# EAGLE design working (EAGLE 7.7.0)
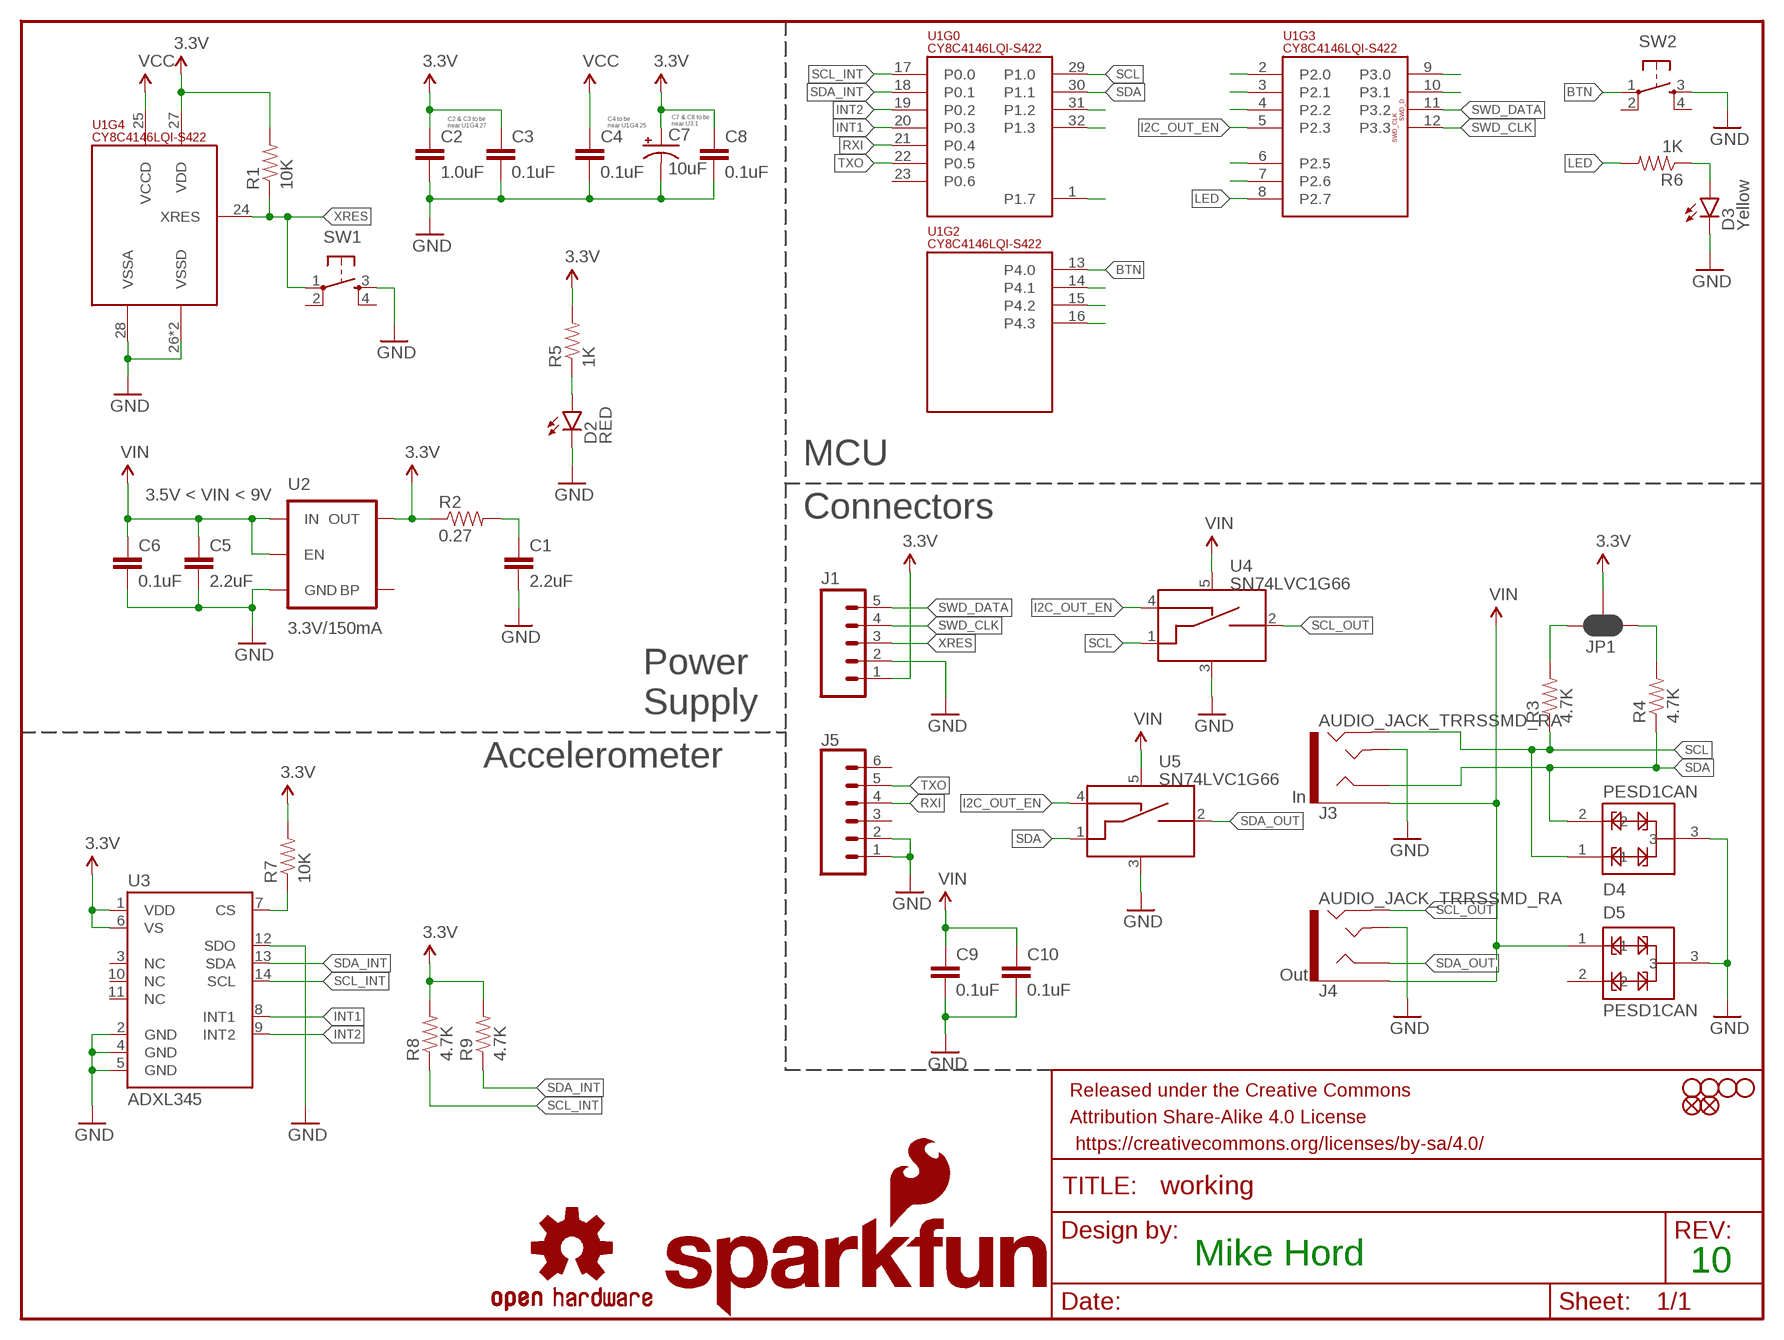
[diagram p0: schematic, sheet 1]

## Parts
C1  2.2uF  2.2UF-10V-20%(0603)  [0603-CAP]
C2  1.0uF  1.0UF-16V-10%(0402)  [0402-CAP]
C3  0.1uF  0.1UF-16V(+-10%)(0402)  [0402-CAP]
C4  0.1uF  0.1UF-16V(+-10%)(0402)  [0402-CAP]
C5  2.2uF  2.2UF-10V-20%(0603)  [0603-CAP]
C6  0.1uF  0.1UF-16V(+-10%)(0402)  [0402-CAP]
C7  10uF  10UF-16V-10%(TANT)  [EIA3216]
C8  0.1uF  0.1UF-16V(+-10%)(0402)  [0402-CAP]
C9  0.1uF  0.1UF-16V(+-10%)(0402)  [0402-CAP]
C10  0.1uF  0.1UF-16V(+-10%)(0402)  [0402-CAP]
D2  RED  LED-RED0603  [LED-0603]
D3  Yellow  LED-YELLOW0603-SMART  [LED-0603]
D4  PESD1CAN  [SOT23-3]
D5  PESD1CAN  [SOT23-3]
FD1  FIDUCIALUFIDUCIAL  [MICRO-FIDUCIAL]
FD2  FIDUCIALUFIDUCIAL  [MICRO-FIDUCIAL]
FRAME1  FRAME-LETTER  [CREATIVE_COMMONS]
H1  STAND-OFF  [STAND-OFF]
H2  STAND-OFF  [STAND-OFF]
H3  STAND-OFF  [STAND-OFF]
H4  STAND-OFF  [STAND-OFF]
J1  M05NO_SILK  [1X05_NO_SILK]
J3  AUDIO_JACK_TRRSSMD_RA  [AUDIO_JACK_3.5MM_TRRS_SMD_RA]
J4  AUDIO_JACK_TRRSSMD_RA  [AUDIO_JACK_3.5MM_TRRS_SMD_RA]
J5  CONN_06NO_SILK_NO_POP  [1X06_NO_SILK]
JP1  JUMPER-PAD-3-NC_BY_PASTE  [PAD-JUMPER-3-NC_BY_PASTE_YES_SILK_FULL_BOX]
LOGO1  SFE_LOGO_NAME_FLAME.1_INCH  [SFE_LOGO_NAME_FLAME_.1]
LOGO2  OSHW-LOGOS  [OSHW-LOGO-S]
LOGO3  OSHW-LOGOS  [OSHW-LOGO-S]
LOGO4  SFE_LOGO_NAME_FLAME.1_INCH  [SFE_LOGO_NAME_FLAME_.1]
R1  10K  10KOHM-1/10W-1%(0603)0603  [0603-RES]
R2  0.27  0.27OHM-1/10W-1%(0603)  [0603-RES]
R3  4.7K  4.7KOHM-1/10W-1%(0603)  [0603-RES]
R4  4.7K  4.7KOHM-1/10W-1%(0603)  [0603-RES]
R5  1K  1KOHM-1/10W-1%(0603)  [0603-RES]
R6  1K  1KOHM-1/10W-1%(0603)  [0603-RES]
R7  10K  10KOHM-1/10W-1%(0603)0603  [0603-RES]
R8  4.7K  4.7KOHM-1/10W-1%(0603)  [0603-RES]
R9  4.7K  4.7KOHM-1/10W-1%(0603)  [0603-RES]
SW1  SWITCH_SPST_4_PINRECT  [TACTILE_SWITCH_SMD_4.6X2.8MM]
SW2  SWITCH_SPST_4_PINRECT  [TACTILE_SWITCH_SMD_4.6X2.8MM]
U1  CY8C4146LQI-S422  PSOC4_4100S_32QFN  [QFN-32]
U2  3.3V/150mA  V_REG_MIC52053.3V  [SOT23-5]
U3  ADXL345  ADXL345"  [ADXL3451:1]
U4  SN74LVC1G66  SN74LVC1G66_SPST_AMUX  [SOT23-5]
U5  SN74LVC1G66  SN74LVC1G66_SPST_AMUX  [SOT23-5]

## Nets
3.3V: C2.1 C3.1 C7.A(+) C8.1 J1.1 JP1.2 R1.2 R2.1 R5.2 R7.2 R8.2 R9.2 U1.27(VDD) U2.5(OUT) U3.1(VDD) U3.6(VS)
BTN: SW2.1 U1.13(P4.0)
GND: C1.2 C2.2 C3.2 C4.2 C5.2 C6.2 C7.C(-) C8.2 C9.2 C10.2 D2.C D3.C D4.3 D5.3 J1.2 J3.TIP J4.TIP J5.1 J5.2 SW1.3 SW2.3 U1.26(VSSD) U1.28(VSSA) U1.EP(VSSD) U2.2(GND) U3.2(GND) U3.4(GND) U3.5(GND) U3.12(SDO) U4.3(VSS) U5.3(VSS)
I2C_OUT_EN: U1.5(P2.3) U4.4(CTRL_IN) U5.4(CTRL_IN)
INT1: U1.20(P0.3) U3.8(INT1)
INT2: U1.19(P0.2) U3.9(INT2)
LED: R6.2 U1.8(P2.7)
N$1: U1.1(P1.7)
N$2: JP1.3 R3.2
N$3: C1.1 R2.2
N$4: D2.A R5.1
N$5: D3.A R6.1
N$6: JP1.1 R4.2
N$7: U1.32(P1.3)
N$8: U1.31(P1.2)
N$9: U1.2(P2.0)
N$10: U1.3(P2.1)
N$11: R7.1 U3.7(CS)
N$12: U1.4(P2.2)
N$14: U1.6(P2.5)
N$15: U1.7(P2.6)
N$16: U1.10(P3.1)
N$17: U1.9(P3.0)
N$18: U1.14(P4.1)
N$19: U1.15(P4.2)
N$20: U1.16(P4.3)
RXI: J5.4 U1.21(P0.4)
SCL: D4.1 J3.RING2 R3.1 U1.29(P1.0) U4.1(A_IN)
SCL_INT: R8.1 U1.17(P0.0) U3.14(SCL)
SCL_OUT: J4.RING2 U4.2(A_OUT)
SDA: D4.2 J3.RING1 R4.1 U1.30(P1.1) U5.1(A_IN)
SDA_INT: R9.1 U1.18(P0.1) U3.13(SDA)
SDA_OUT: J4.RING1 U5.2(A_OUT)
SWD_CLK: J1.4 U1.12(P3.3)
SWD_DATA: J1.5 U1.11(P3.2)
TXO: J5.5 U1.22(P0.5)
VCC: C4.1 U1.25(VCCD)
VIN: C5.1 C6.1 C9.1 C10.1 D5.1 J3.EARTH J4.EARTH U2.1(IN) U2.3(EN) U4.5(VCC) U5.5(VCC)
XRES: J1.3 R1.1 SW1.1 U1.24(XRES)
Unconnected: D5.2 J5.3 J5.6 SW1.2 SW1.4 SW2.2 SW2.4 U1.23(P0.6) U2.4(BP) U3.3(NC) U3.10(NC) U3.11(NC)

## Notes on the sheet
- C7 & C8 to be
  near U3.1
- C2 & C3 to be
  near U1G4.27
- C4 to be
  near U1G4.25
- MCU
- 3.5V < VIN < 9V
- Connectors
- Power
  Supply
- Accelerometer
- In
- Out
- Mike Hord | 10

## Library data of the parts
C1 C5 = SparkFun-Capacitors:2.2UF-10V-20%(0603): CAP-07888; PROD_ID: CAP-07888
C2 = SparkFun-Capacitors:1.0UF-16V-10%(0402); PROD_ID: CAP-12417
C3 C4 C6 C8-C10 = SparkFun-Capacitors:0.1UF-16V(+-10%)(0402); PROD_ID: CAP-12416
C7 = SparkFun-Capacitors:10UF-16V-10%(TANT): CAP-00811 1206/EIA-3216 Tantalum capacitor; PROD_ID: CAP-00811
D2 = SparkFun-LED:LED-RED: Assorted Red LEDs LilyPad 1206- DIO-09912 1206- DIO-00809 0603- DIO-00819 "SMART" means more efficient and expensive; PROD_ID: DIO-00819
D3 = SparkFun-LED:LED-YELLOW: Yellow SMD LEDs LilyPad 1206- DIO-09909 0603- DIO-09003 "SMART" means more efficient and expensive; PROD_ID: DIO-11230
D4 D5 = SparkFun-DiscreteSemi:PESD1CAN: PESD1CAN is used to protect two automotive CAN bus lines from ESD.; PROD_ID: DIO-12501
FD1 FD2 = SparkFun-Aesthetics:FIDUCIAL: Fiducial Alignment Points Various fiducial points for machine vision alignment.
FRAME1 = SparkFun-Aesthetics:FRAME-LETTER: Schematic Frame Standard 8.5x11 US Letter frame
H1-H4 = SparkFun-Electromechanical:STAND-OFF: #4 Stand Off This is the mechanical footprint for a #4 phillips button head screw. Use the keepout ring to avoid running the screw head into surrounding components. SKU : PRT-00447
J1 = SparkFun-Connectors:M05: Header 5 Standard 5-pin 0.1" header. Use with straight break away headers (SKU : PRT-00116), right angle break away headers (PRT-00553), swiss pins (PRT-00743), machine pins (PRT-00117), and female headers (PRT-00115). Molex polarized connector foot print use with SKU : PRT-08230 with associated crimp pins and housings.
J3 J4 = SparkFun-Connectors:AUDIO_JACK_TRRS: Audio Jack - 3.5mm TRRS (SMD) This is a 3.5mm TRRS SMD audio jack. TRRS connectors are the audio-style connectors that you see on some phones, MP3 players and development boards. TRRS stands for “tip, ring, ring, sleeve,” which reflects that this has three conductors and a ground. SparkFun Products: Audio Jack <https://www.sparkfun.com/products/12639> mbed Starter Kit <https://www.sparkfun.com/products/12968> SparkFun TRRS 3.5mm Jack Breakout <https://www.sparkfun.com/products/11570>; PROD_ID: CONN-10676; SF_ID: PRT-12639
J5 = SparkFun-Connectors:CONN_06: Multi connection point. Often used as Generic Header-pin footprint for 0.1 inch spaced/style header connections On any of the 0.1 inch spaced packages, you can populate with these: Break Away Headers - Straight <https://www.sparkfun.com/products/116> (PRT-00116) Break Away Male Headers - Right Angle <https://www.sparkfun.com/products/553> (PRT-00553) Female Headers <https://www.sparkfun.com/products/115> (PRT-00115) Break Away Headers - Machine Pin <https://www.sparkfun.com/products/117> (PRT-00117) Break Away Female Headers - Swiss Machine Pin <https://www.sparkfun.com/products/743> (PRT-00743) Arduino Stackable Header - 6 Pin <https://www.sparkfun.com/products/9280> (PRT-09280) For SCREWTERMINALS and SPRING TERMINALS visit here: Screw Terimnals on SparkFun.com <https://www.sparkfun.com/search/results?term=Screw+Terminals> (5mm/3.5mm/2.54mm spacing) This device is also useful as a general connection point to wire up your design to another part of your project. Our various solder wires solder well into these plated through hole pads. Hook-Up Wire - Assortment (Stranded, 22 AWG) <https://www.sparkfun.com/products/11375> (PRT-11375) Hook-Up Wire - Assortment (Solid Core, 22 AWG) <https://www.sparkfun.com/products/11367> (PRT-11367) View the entire wire category on our website here <https://www.sparkfun.com/categories/141>
JP1 = SparkFun-Passives:JUMPER-PAD-3-NC_BY_PASTE
LOGO1 LOGO4 = SparkFun-Aesthetics:SFE_LOGO_NAME_FLAME: SFE Logo, name and flame This is the SparkFun full logo. The logo on the schematic will always be the same size; the package variant is the height of the flame part of the logo. Default layer for the logo on the board is tSilk.
LOGO2 LOGO3 = SparkFun-Aesthetics:OSHW-LOGO: Open Source Hardware Logo This logo indicates the piece of hardware it is found on incorporates a OSHW license and/or adheres to the definition of open source hardware found here: http://freedomdefined.org/OSHW
R1 R7 = SparkFun-Resistors:10KOHM-1/10W-1%(0603): RES-00824; PROD_ID: RES-00824
R2 = SparkFun-Resistors:0.27OHM-1/10W-1%(0603): RES-08787; PROD_ID: RES-08787
R3 R4 R8 R9 = SparkFun-Resistors:4.7KOHM-1/10W-1%(0603): RES-07857; PROD_ID: RES-07857
R5 R6 = SparkFun-Resistors:1KOHM-1/10W-1%(0603): RES-07856; PROD_ID: RES-07856
SW1 SW2 = SparkFun-Electromechanical:SWITCH_SPST_4_PIN; PROD_ID: SWCH-13065
U1 = SparkFun-DigitalIC:PSOC4_4100S_32QFN; PROD_ID: IC-13286
U2 = SparkFun-PowerIC:V_REG_MIC5205: V_REG MIC5205 Standard 3.3V, 5V, and Adjustable 150mA LDO voltage regulator in SOT-23 layout. Micrel part MIC5205. BP (by-pass) pin is used to lower output noise with 470pF cap, may be left open. On the adjustable version BP is used to set output.; PROD_ID: VREG-00822
U3 = SparkFun-Sensors:ADXL345: 3-axis SPI/I2C 2/4/8/16g accelerometer; PROD_ID: IC-09097
U4 U5 = SparkFun-AnalogIC:SN74LVC1G66_SPST_AMUX: SPST NO Analog Switch 10-Ohm on resistance 1.65-5.5V; PROD_ID: IC-13549

## Board
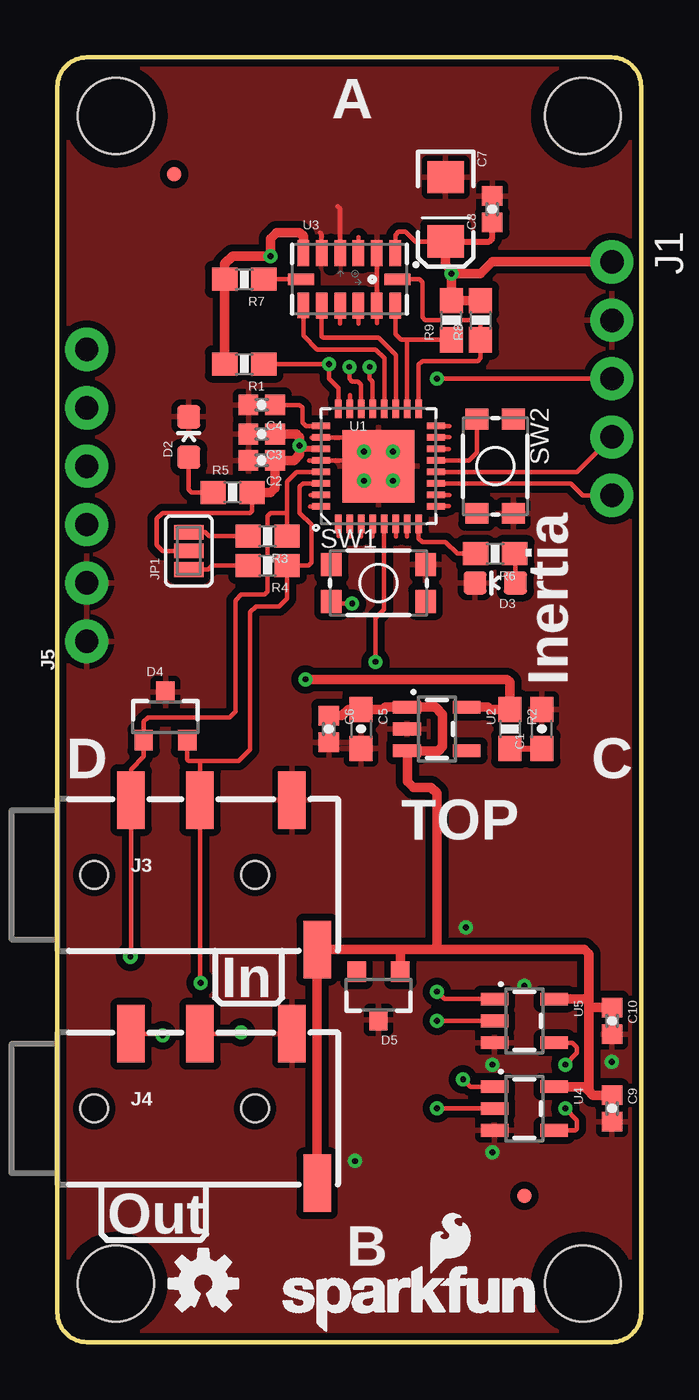
[diagram p1: board, top side]
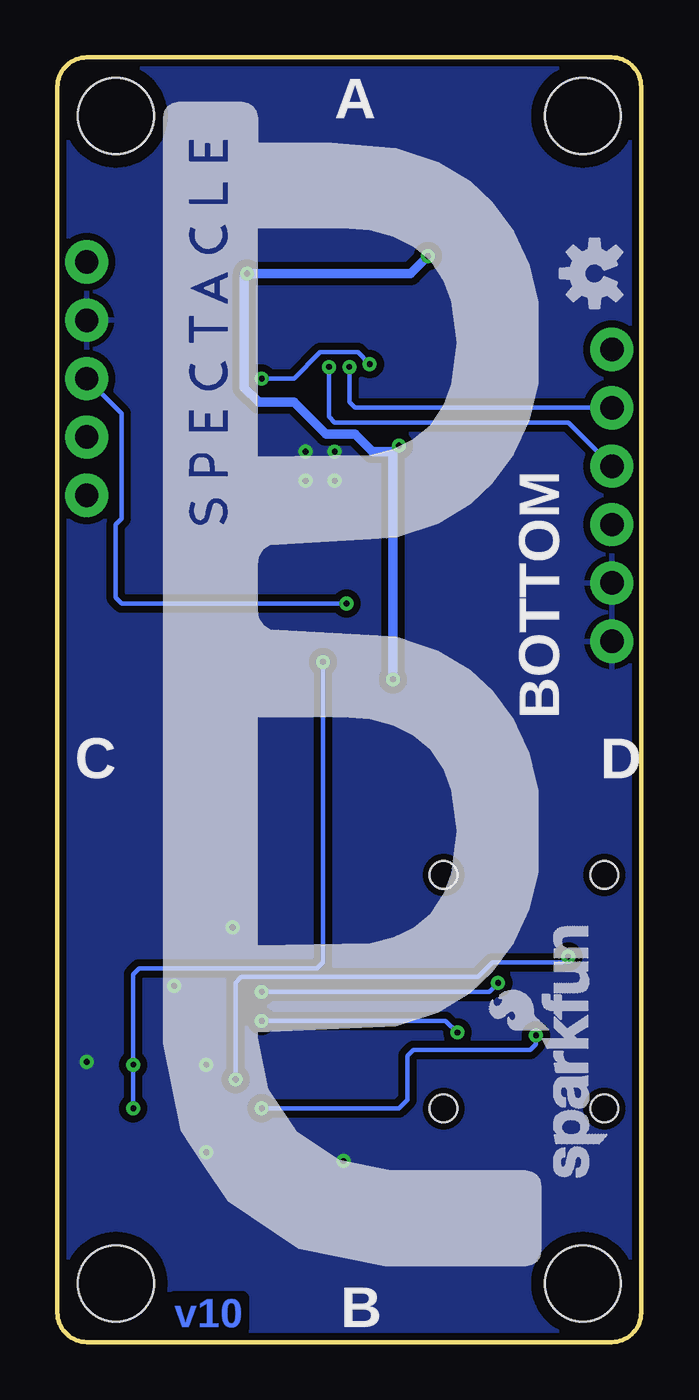
[diagram p2: board, bottom side, seen from below]

Size 25.4 x 55.88 mm. Coordinates in mm from the lower left corner, seen from the top.
Outline: 0,1.27 0,54.61 arc-90 1.27,55.88 24.13,55.88 arc-90 25.4,54.61 25.4,1.27 arc-90 24.13,0 1.27,0 arc-90 0,1.27
Copper layers (1*16): Top 0.035mm / dielectric 1.5mm / Bottom 0.035mm
Design rules "SparkFun-2-layer-TIGHT": minimum track width 7mil, minimum drill 15mil, track to track 7mil, track to pad 7mil, pad to pad 7mil, via to via 7mil, smd to smd 7mil, copper to edge 7mil, drill to drill 7mil, minimum pad ring 7mil, minimum via ring 7mil, stop-mask expansion 4mil, vias tented up to drill 25mil, thermal gap 10mil

### Footprints (pad centres in the part's own frame; a part is rotated, then mirrored left to right if it is on the bottom)
0603-CAP = smd 1.1 x 1: 1 -0.85,0; 2 0.85,0
0402-CAP = smd 0.85 x 0.9: 1 -0.58,0; 2 0.58,0
EIA3216 = smd 1.4 x 1.6: A 1.4,0; C -1.4,0
LED-0603 = smd 1 x 1: A 0,-0.877; C 0,0.877
SOT23-3 = smd 0.8 x 0.9: 1 -0.95,-1; 2 0.95,-1; 3 0,1.1
MICRO-FIDUCIAL = smd 0.635 x 0.635: 1 0,0
STAND-OFF = hole 3.302: 0,0
1X05_NO_SILK = drill 1.016 pad 1.88: 1 0,0; 2 2.54,0; 3 5.08,0; 4 7.62,0; 5 10.16,0
AUDIO_JACK_3.5MM_TRRS_SMD_RA = smd 1.2 x 2.5: EARTH 11.3,-3.25; RING1 6.2,3.25; RING2 3.2,3.25; TIP 10.2,3.25 | hole 1.2: 1.6,0; 8.6,0
1X06_NO_SILK = drill 1.016 pad 1.88: 1 0,0; 2 2.54,0; 3 5.08,0; 4 7.62,0; 5 10.16,0; 6 12.7,0
PAD-JUMPER-3-NC_BY_PASTE_YES_SILK_FULL_BOX = smd 0.635 x 1.27: 1 -0.813,0; 2 0,0; 3 0.813,0
0603-RES = smd 1.1 x 1: 1 -0.85,0; 2 0.85,0
TACTILE_SWITCH_SMD_4.6X2.8MM = smd 0.9 x 1: 1 -2.05,-0.8; 2 2.05,-0.8; 3 2.05,0.8; 4 -2.05,0.8
QFN-32 = smd 0.285 x 0.8: 1 -1.75,-2.5; 2 -1.25,-2.5; 3 -0.75,-2.5; 4 -0.25,-2.5; 5 0.25,-2.5; 6 0.75,-2.5; 7 1.25,-2.5; 8 1.75,-2.5; 17 1.75,2.5; 18 1.25,2.5; 19 0.75,2.5; 20 0.25,2.5; 21 -0.25,2.5; 22 -0.75,2.5; 23 -1.25,2.5; 24 -1.75,2.5 | smd 0.8 x 0.285: 9 2.5,-1.75; 10 2.5,-1.25; 11 2.5,-0.75; 12 2.5,-0.25; 13 2.5,0.25; 14 2.5,0.75; 15 2.5,1.25; 16 2.5,1.75; 25 -2.5,1.75; 26 -2.5,1.25; 27 -2.5,0.75; 28 -2.5,0.25; 29 -2.5,-0.25; 30 -2.5,-0.75; 31 -2.5,-1.25; 32 -2.5,-1.75 | smd 3.15 x 3.15: EP 0,0
SOT23-5 = smd 0.55 x 1.2: 1 -0.95,-1.3; 2 0,-1.3; 3 0.95,-1.3; 4 0.95,1.3; 5 -0.95,1.3
ADXL3451:1 = smd 0.5 x 1.124: 1 2,1.138; 2 1.2,1.138; 3 0.4,1.138; 4 -0.4,1.138; 5 -1.2,1.138; 6 -2,1.138; 8 -2,-1.13; 9 -1.2,-1.138; 10 -0.4,-1.138; 11 0.4,-1.138; 12 1.2,-1.138; 13 2,-1.138 | smd 1.124 x 0.5: 7 -2.1,0; 14 2.1,0

### Placement (x,y rotation side)
C1  21.08,26.67 90 top
C2  8.89,38.35 180 top
C3  8.89,39.5 180 top
C4  8.89,40.77 180 top
C5  13.21,26.67 270 top
C6  11.81,26.67 270 top
C7  16.89,49.28 270 top
C8  18.92,49.28 90 top
C9  24.13,10.16 270 top
C10  24.13,13.97 270 top
D2  5.71,39.37 0 top
D3  19.05,33.02 90 top
D4  4.7,27.18 0 top
D5  13.97,15.11 180 top
FD1  20.32,6.35 0 top
FD2  5.08,50.8 0 top
FRAME1  20.32,-20.32 0 top  (outside the outline)
H1  22.86,53.34 0 top
H2  2.54,53.34 0 top
H3  22.86,2.54 0 top
H4  2.54,2.54 0 top
J1  24.13,46.99 270 top
J3  0,20.32 0 top
J4  0,10.16 0 top
J5  1.27,30.48 90 top
JP1  5.71,34.42 90 top
LOGO1  9.4,0.38 0 top
LOGO2  6.35,2.54 0 top
LOGO3  2.03,46.48 90 bottom
LOGO4  1.4,6.73 90 bottom
R1  8.13,42.55 180 top
R2  19.68,26.67 270 top
R3  9.14,35.05 180 top
R4  9.14,33.78 180 top
R5  7.62,36.96 0 top
R6  19.05,34.29 180 top
R7  8.13,46.23 180 top
R8  18.41,44.45 90 top
R9  17.14,44.45 90 top
SW1  13.97,33.02 0 top
SW2  19.05,38.1 270 top
U1  13.97,38.1 0 top
U2  16.51,26.67 270 top
U3  12.7,46.23 0 top
U4  20.32,10.16 270 top
U5  20.32,13.97 270 top
U$4  [SPECTACLE_LOGO_NEGATIVE_2.2X1.0]  4.32,3.3 90 bottom

### Tracks (layer width: path | path; a pad name or v marks a point on that pad's centre or on a via)
3.3V  (via drill 0.25)
  Top 0.203: 10.55,38.85 10.54,38.86 | R5.2 8.47,36.16 8.38,36.07 4.57,36.07 4.32,35.81 4.32,34.67 4.57,34.42 JP1.2 | 14.7,47.72 14.7,48.16 14.84,48.3 15.15,48.3 15.57,47.88 C7.A
  Top 0.254: U1.27 10.55,38.85 | U3.1 14.7,47.72 | C7.A 18.79,47.88 18.92,48.01 C8.1
  Top 0.406: U2.5 18.73,27.62 18.84,27.52 R2.1 19.68,28.7 19.56,28.83 v10.79,28.83 | C3.1 10.41,39.5 10.54,39.37 v10.54,38.99 10.54,38.86 10.54,38.61 10.29,38.35 C2.1 9.47,37.16 9.27,36.96 R5.2 | v17.14,46.48 R9.2 R8.2 | v17.14,46.48 17.14,46.61 16.89,46.86 C7.A | J1.1 18.92,46.99 18.41,46.48 v17.14,46.48 | U3.6 10.7,48.1 10.54,48.26 9.53,48.26 9.27,48.01 v9.27,47.24 7.62,47.24 7.28,46.9 R7.2 R1.2
  Bottom 0.406: v10.79,28.83 10.79,38.73 | 10.79,38.73 v10.54,38.99 | 10.79,38.73 11.68,38.73 12.45,39.5 13.72,39.5 15.11,40.89 16.64,40.89 17.27,41.53 17.27,46.35 v17.14,46.48 10.03,46.48 v9.27,47.24
BTN
  Top 0.203: SW2.1 18.25,38.7 17.9,38.35 U1.13
GND  (via drill 0.25)
  Top 0.203: 12.3,47.86 U3.4 12.3,49.3 12.19,49.4 | U3.5 11.5,48.19 11.43,48.26 | U1.26 12.72,39.35 U1.EP | U1.EP 13.72,38.35 U1.28 10.95,38.35 | v14.61,38.73 U1.EP | U3.2 U3.12
  other vias: 14.61,37.47 13.34,37.47 12.95,7.87 24.13,12.19 18.92,12.06 18.92,8.26 17.78,18.03 20.32,15.49 13.34,38.73
  pour Bottom (isolate 0.305): 0,1.27 0,54.61 arc-90 1.27,55.88 24.13,55.88 arc-90 25.4,54.61 25.4,1.27 arc-90 24.13,0 1.27,0 arc-90
  pour Top (isolate 0.305): 0,1.27 0,54.61 arc-90 1.27,55.88 24.13,55.88 arc-90 25.4,54.61 25.4,1.27 arc-90 24.13,0 1.27,0 arc-90
I2C_OUT_EN  (via drill 0.25)
  Top 0.203: U1.5 14.22,31.87 13.84,31.5 v13.84,29.59 | U4.4 22.55,9.21 22.61,9.27 22.61,9.65 v22.1,10.16 | U5.4 22.41,13.02 22.61,12.83 22.61,12.57 v22.1,12.06
  Bottom 0.203: v13.84,29.59 13.84,16.51 14.1,16.26 21.84,16.26 22.1,16 v22.1,12.06 v22.1,10.16
INT1
  Top 0.203: U3.8 10.7,43.78 11.3,43.18 13.84,43.18 14.22,42.8 U1.20
INT2
  Top 0.203: U1.19 14.73,40.61 14.73,42.93 13.97,43.69 11.56,43.69 11.5,43.74 U3.9
LED
  Top 0.203: U1.8 15.72,34.95 15.88,34.8 16.89,34.8 17.4,34.29 R6.2
N$2
  Top 0.203: JP1.3 6.43,35.23 6.6,35.05 R3.2
N$3
  Top 0.254: R2.2 C1.1
N$4
  Top 0.203: R5.1 5.84,36.96 5.71,37.08 D2.A
N$5
  Top 0.203: D3.A 19.93,34.26 R6.1
N$6
  Top 0.203: JP1.1 6.55,33.6 6.73,33.78 R4.2
N$9
  Top 0.203: U1.2 12.72,35.03
N$10
  Top 0.203: U1.3 13.22,35.03
N$11
  Top 0.203: R7.1 U3.7
N$15
  Top 0.203: U1.7 15.22,35.03
N$21
  Top 0.203: 16.49,39.84 17.05,39.84
N$22
  Top 0.203: 16.49,39.36 17.05,39.36
N$23
  Top 0.203: 16.48,38.85 17.03,38.85
N$24
  Top 0.203: 12.22,35.62 12.22,35.06
N$25
  Top 0.203: 13.72,35.6 13.72,35.03
N$26
  Top 0.203: 16.5,36.85 17.05,36.85
N$27
  Top 0.203: 14.73,35.61 14.73,35.03
N$28
  Top 0.203: 16.47,36.36 17.03,36.36
N$29
  Top 0.203: 12.72,40.6 12.72,41.2
N$30
  Top 0.203: 11.46,39.34 11.05,39.34
N$31
  Top 0.203: 13.1,47.42 13.1,48.06
N$32
  Top 0.203: 12.3,45.07 12.3,44.31
N$33
  Top 0.203: 13.1,45.21 13.1,44.31
N$34
  Top 0.203: 11.52,36.85 11.02,36.85
N$35
  Top 0.203: 11.5,36.35 11,36.35
N$36
  Top 0.203: 13.9,44.96 13.9,44.32
RXI  (via drill 0.25)
  Top 0.203: v13.59,42.42 13.59,41.91 13.72,41.78 U1.21
  Bottom 0.203: v13.59,42.42 13.59,40.26 13.34,40.01 3.17,40.01 J5.4
SCL  (via drill 0.25)
  Top 0.203: R3.1 9.99,36.07 | 9.99,36.07 9.99,37.43 10.41,37.85 U1.29 | U4.1 17.97,11.11 v17.65,11.43 | v3.17,16.76 3.2,16.79 J3.RING2 3.2,24.92 3.75,25.47 D4.1 3.75,26.99 3.94,27.18 7.49,27.18 7.75,27.43 7.75,32.26 8,32.51 9.02,32.51 9.14,32.64 9.14,35.94 9.27,36.07 9.99,36.07
  Bottom 0.203: v17.65,11.43 17.65,15.62 17.4,15.88 7.11,15.88 6.48,16.51 3.43,16.51 v3.17,16.76
SCL_INT
  Top 0.203: U1.17 15.72,42.52 15.88,42.67 18.29,42.67 18.41,42.8 R8.1 18.41,44.32 18.29,44.45 16,44.45 15.88,44.58 15.88,46.1 15.75,46.23 U3.14
SCL_OUT  (via drill 0.25)
  Top 0.203: U4.2 v16.51,10.16 | J4.RING2 4.5,13.41 v4.57,13.34
  Bottom 0.203: v16.51,10.16 10.54,10.16 10.16,10.54 10.16,12.45 9.91,12.7 4.83,12.7 4.57,12.95 v4.57,13.34
SDA  (via drill 0.25)
  Top 0.203: U1.30 10.68,37.35 10.54,37.21 10.54,36.07 11.05,35.56 11.05,33.91 10.92,33.78 R4.1 9.99,32.35 9.65,32 8.64,32 8.38,31.75 8.38,25.78 7.87,25.27 6.2,25.27 | J3.RING1 6.2,25.27 | D4.2 5.65,25.34 5.71,25.27 6.2,25.27 | U5.1 16.83,14.92 v16.51,15.24 | 6.2,22.71 6.2,15.64 v6.22,15.62
  Top 0.254: 6.2,22.71 6.35,22.86 6.35,23.42 J3.RING1
  Bottom 0.203: v16.51,15.24 6.6,15.24 v6.22,15.62
SDA_INT
  Top 0.203: R9.1 15.2,43.6 | U3.13 14.7,43.85 14.95,43.6 15.2,43.6 | U1.18 15.22,43.58 15.2,43.6
SDA_OUT  (via drill 0.25)
  Top 0.203: U5.2 v16.51,13.97 | J4.RING1 7.95,13.41 v8,13.46
  Bottom 0.203: v16.51,13.97 8.51,13.97 v8,13.46
SWD_CLK
  Top 0.203: U1.12 22.61,37.85 J1.4
SWD_DATA
  Top 0.203: U1.11 22.34,37.35 22.86,36.83 J1.5
TXO  (via drill 0.25)
  Top 0.203: v12.7,42.42 12.7,41.91 12.83,41.78 13.08,41.78 13.22,41.64 U1.22
  Bottom 0.203: v12.7,42.42 12.7,40.89 12.45,40.64 J5.5
VCC
  Top 0.203: U1.25 10.82,39.85 10.67,40.01 10.67,40.64 10.54,40.77 C4.1
VIN
  Top 0.406: C6.1 12.39,27.25 12.66,27.52 C5.1 14.19,27.52 14.29,27.62 U2.1 16.45,27.62 16.76,27.3 16.76,25.91 16.58,25.72 U2.3 15.24,25.69 15.24,24.38 15.49,24.13 16.26,24.13 16.51,23.88 16.51,17.07 | J3.EARTH 11.43,17.07 | 11.43,17.07 14.99,17.07 | D5.1 14.92,17 14.99,17.07 | 14.99,17.07 16.51,17.07 | 16.51,17.07 22.93,17.07 23.11,16.89 23.11,14.86 | 23.11,14.86 23.11,14.61 | 23.11,14.61 23.11,10.92 | U4.5 22.93,11.11 23.11,10.92 | U5.5 23.05,14.92 23.11,14.86 | J4.EARTH 11.3,16.94 11.43,17.07 | 23.11,10.92 23.3,10.74 C9.1 | C10.1 23.17,14.55 23.11,14.61
XRES  (via drill 0.25)
  Top 0.203: v16.51,41.91 J1.3 | R1.1 v11.81,42.55 11.81,41.91 12.22,41.5 U1.24 | v12.83,32.13 12.01,32.13 SW1.1
  Bottom 0.203: v11.81,42.55 12.32,43.05 13.97,43.05 15.11,41.91 v16.51,41.91 | J1.3 22.61,40.39 22.61,35.81 22.86,35.56 22.86,32.38 22.61,32.13 v12.83,32.13

### Text on the board
Bottom: v10
tPlace: A | Inertia | D | C | TOP | In | Out | B
bPlace: A | BOTTOM | D | C | B
Measures: (typ.) | (typ.) | Dimensions given in INCHES
tDocu: Mike Hord